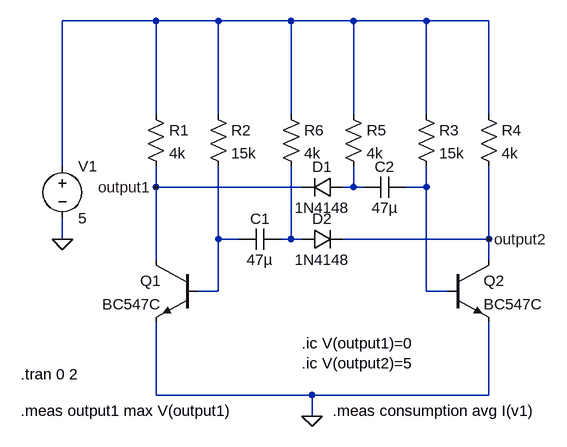
[diagram p0: schematic blinking-basic-low-diodes.asc]
blinking-basic-low-diodes.asc, the LTspice schematic file:
Version 4
SHEET 1 880 680
WIRE -208 -80 -352 -80
WIRE -112 -80 -208 -80
WIRE 0 -80 -112 -80
WIRE 96 -80 0 -80
WIRE 208 -80 96 -80
WIRE 304 -80 208 -80
WIRE -208 64 -208 -80
WIRE -112 64 -112 -80
WIRE 0 64 0 -80
WIRE 96 64 96 -80
WIRE 208 64 208 -80
WIRE 304 64 304 -80
WIRE -352 144 -352 -80
WIRE -208 176 -208 144
WIRE 16 176 -208 176
WIRE 96 176 96 144
WIRE 96 176 80 176
WIRE 112 176 96 176
WIRE 208 176 208 144
WIRE 208 176 176 176
WIRE -352 256 -352 224
WIRE -112 256 -112 144
WIRE -80 256 -112 256
WIRE 0 256 0 144
WIRE 0 256 -16 256
WIRE 16 256 0 256
WIRE 304 256 304 144
WIRE 304 256 80 256
WIRE -208 288 -208 176
WIRE 304 288 304 256
WIRE -112 336 -112 256
WIRE -112 336 -144 336
WIRE 208 336 208 176
WIRE 240 336 208 336
WIRE -208 496 -208 384
WIRE 32 496 -208 496
WIRE 304 496 304 384
WIRE 304 496 32 496
WIRE 32 528 32 496
FLAG 32 528 0
FLAG -352 256 0
FLAG -208 176 output1
FLAG 304 256 output2
SYMBOL npn -144 288 M0
SYMATTR InstName Q1
SYMATTR Value BC547C
SYMBOL npn 240 288 R0
SYMATTR InstName Q2
SYMATTR Value BC547C
SYMBOL Cap 176 160 R90
WINDOW 0 0 32 VBottom 2
WINDOW 3 32 32 VTop 2
SYMATTR InstName C2
SYMATTR Value 47µ
SYMBOL Cap -16 240 R90
WINDOW 0 0 32 VBottom 2
WINDOW 3 32 32 VTop 2
SYMATTR InstName C1
SYMATTR Value 47µ
SYMBOL Res -128 48 R0
SYMATTR InstName R2
SYMATTR Value 15k
SYMBOL Res 192 48 R0
SYMATTR InstName R3
SYMATTR Value 15k
SYMBOL Res -224 48 R0
SYMATTR InstName R1
SYMATTR Value 4k
SYMBOL Res 288 48 R0
SYMATTR InstName R4
SYMATTR Value 4k
SYMBOL Voltage -352 128 R0
SYMATTR InstName V1
SYMATTR Value 5
SYMBOL Res 80 48 R0
SYMATTR InstName R5
SYMATTR Value 4k
SYMBOL Res -16 48 R0
SYMATTR InstName R6
SYMATTR Value 4k
SYMBOL diode 80 160 R90
WINDOW 0 0 32 VBottom 2
WINDOW 3 32 32 VTop 2
SYMATTR InstName D1
SYMATTR Value 1N4148
SYMBOL diode 16 272 R270
WINDOW 0 32 32 VTop 2
WINDOW 3 0 32 VBottom 2
SYMATTR InstName D2
SYMATTR Value 1N4148
TEXT -416 464 Left 2 !.tran 0 2
TEXT 16 416 Left 2 !.ic V(output1)=0\n.ic V(output2)=5
TEXT -416 520 Left 2 !.meas output1 max V(output1)
TEXT 64 520 Left 2 !.meas consumption avg I(v1)

The netlist it stands for:
* blinking-basic-low-diodes.asc
Q1 output1 N004 0 0 BC547C
Q2 output2 N003 0 0 BC547C
C2 N003 N002 47µ
C1 N005 N004 47µ
R2 N001 N004 15k
R3 N001 N003 15k
R1 N001 output1 4k
R4 N001 output2 4k
V1 N001 0 5
R5 N001 N002 4k
R6 N001 N005 4k
D1 N002 output1 1N4148
D2 N005 output2 1N4148
.model D D
.lib standard.dio
.model NPN NPN
.model PNP PNP
.lib standard.bjt
.tran 0 2
.ic V(output1)=0
.ic V(output2)=5
.meas output1 max V(output1)
.meas consumption avg I(v1)
.backanno
.end